# EAGLE schematic StellariSpiAlt (EAGLE 6.4)
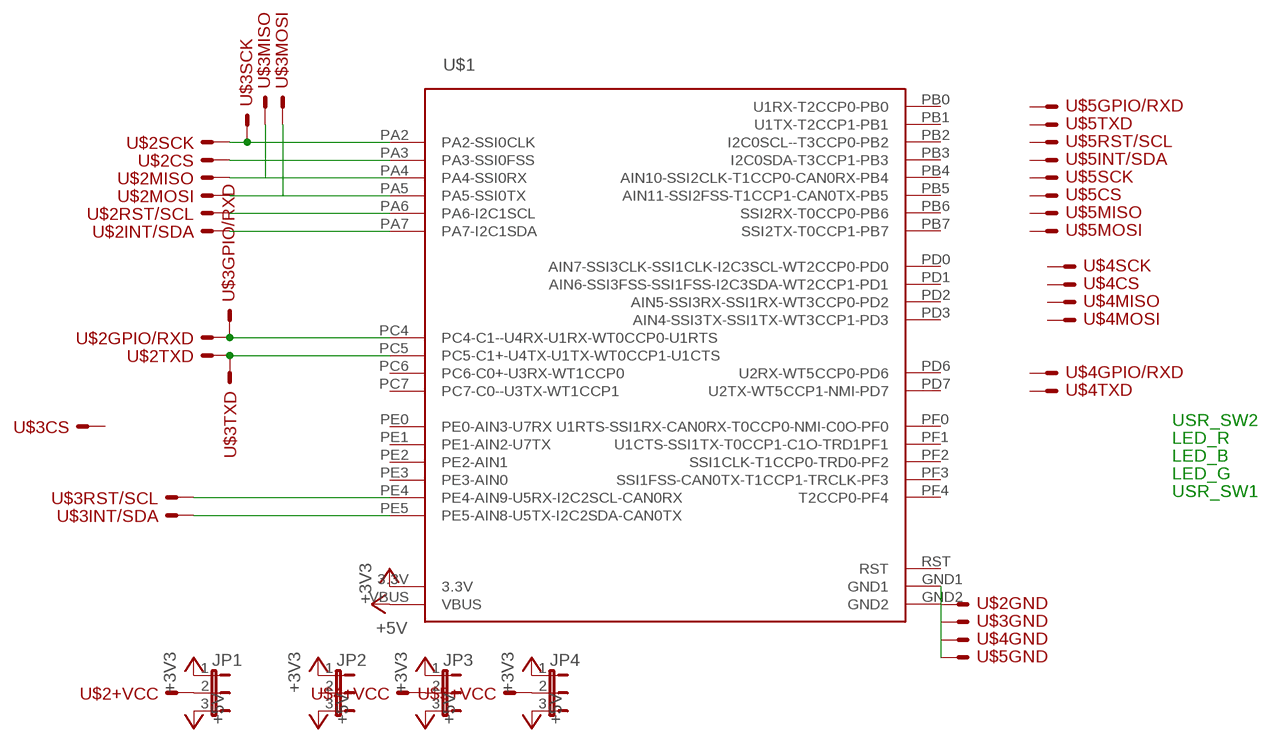
[diagram p0: schematic, sheet 1]

## Parts
JP1  JP2E  [JP2]
JP2  JP2E  [JP2]
JP3  JP2E  [JP2]
JP4  JP2E  [JP2]
U$1  STELLARIS-LAUNCHPADSTELLARIS-LAUNCHPAD-XL  [LAUNCHPAD-XL]
U$2  SPI_BUS2  [SPI_BUS2]
U$3  SPI_BUS2  [SPI_BUS2]
U$4  SPI_BUS2  [SPI_BUS2]
U$5  SPI_BUS2  [SPI_BUS2]

## Nets
+3V3: JP1.1 JP2.1 JP3.1 JP4.1 U$1.3.3V
+5V: JP1.3 JP2.3 JP3.3 JP4.3 U$1.VBUS
N$1: U$1.PA2(PA2-SSI0CLK) U$2.SCK U$3.SCK
N$2: U$1.PA4(PA4-SSI0RX) U$2.MISO U$3.MISO
N$3: U$1.PA5(PA5-SSI0TX) U$2.MOSI U$3.MOSI
N$4: U$1.PA3(PA3-SSI0FSS) U$2.CS
N$5: U$1.PC5(PC5-C1+-U4TX-U1TX-WT0CCP1-U1CTS) U$2.TXD U$3.TXD
N$6: JP1.2 U$2.+VCC
N$7: U$1.GND1 U$1.GND2 U$2.GND U$3.GND U$4.GND U$5.GND
N$8: U$1.PE4(PE4-AIN9-U5RX-I2C2SCL-CAN0RX) U$3.RST/SCL
N$9: U$1.PE5(PE5-AIN8-U5TX-I2C2SDA-CAN0TX) U$3.INT/SDA
N$20: U$1.PA6(PA6-I2C1SCL) U$2.RST/SCL
N$21: U$1.PA7(PA7-I2C1SDA) U$2.INT/SDA
N$22: U$1.PC4(PC4-C1--U4RX-U1RX-WT0CCP0-U1RTS) U$2.GPIO/RXD U$3.GPIO/RXD
N$36: JP3.2 U$4.+VCC
N$37: JP4.2 U$5.+VCC
Unconnected: JP2.2 U$1.PB0(U1RX-T2CCP0-PB0) U$1.PB1(U1TX-T2CCP1-PB1) U$1.PB2(I2C0SCL--T3CCP0-PB2) U$1.PB3(I2C0SDA-T3CCP1-PB3) U$1.PB4(AIN10-SSI2CLK-T1CCP0-CAN0RX-PB4) U$1.PB5(AIN11-SSI2FSS-T1CCP1-CAN0TX-PB5) U$1.PB6(SSI2RX-T0CCP0-PB6) U$1.PB7(SSI2TX-T0CCP1-PB7) U$1.PC6(PC6-C0+-U3RX-WT1CCP0) U$1.PC7(PC7-C0--U3TX-WT1CCP1) U$1.PD0(AIN7-SSI3CLK-SSI1CLK-I2C3SCL-WT2CCP0-PD0) U$1.PD1(AIN6-SSI3FSS-SSI1FSS-I2C3SDA-WT2CCP1-PD1) U$1.PD2(AIN5-SSI3RX-SSI1RX-WT3CCP0-PD2) U$1.PD3(AIN4-SSI3TX-SSI1TX-WT3CCP1-PD3) U$1.PD6(U2RX-WT5CCP0-PD6) U$1.PD7(U2TX-WT5CCP1-NMI-PD7) U$1.PE0(PE0-AIN3-U7RX) U$1.PE1(PE1-AIN2-U7TX) U$1.PE2(PE2-AIN1) U$1.PE3(PE3-AIN0) U$1.PF0(U1RTS-SSI1RX-CAN0RX-T0CCP0-NMI-C0O-PF0) U$1.PF1(U1CTS-SSI1TX-T0CCP1-C1O-TRD1PF1) U$1.PF2(SSI1CLK-T1CCP0-TRD0-PF2) U$1.PF3(SSI1FSS-CAN0TX-T1CCP1-TRCLK-PF3) U$1.PF4(T2CCP0-PF4) U$3.+VCC U$3.CS U$4.CS U$4.GPIO/RXD U$4.INT/SDA U$4.MISO U$4.MOSI U$4.RST/SCL U$4.SCK U$4.TXD U$5.CS U$5.GPIO/RXD U$5.INT/SDA U$5.MISO U$5.MOSI U$5.RST/SCL U$5.SCK U$5.TXD

## Notes on the sheet
- USR_SW2
- LED_R
- LED_B
- LED_G
- USR_SW1

## Power pins joined to a net without a drawn wire
RST: U$1.RST

## Library data of the parts
JP1-JP4 = jumper:JP2E: JUMPER
U$1 = lieven:STELLARIS-LAUNCHPAD
U$2-U$5 = lieven:SPI_BUS2